# EAGLE schematic mainBoard (EAGLE 9.6.2)
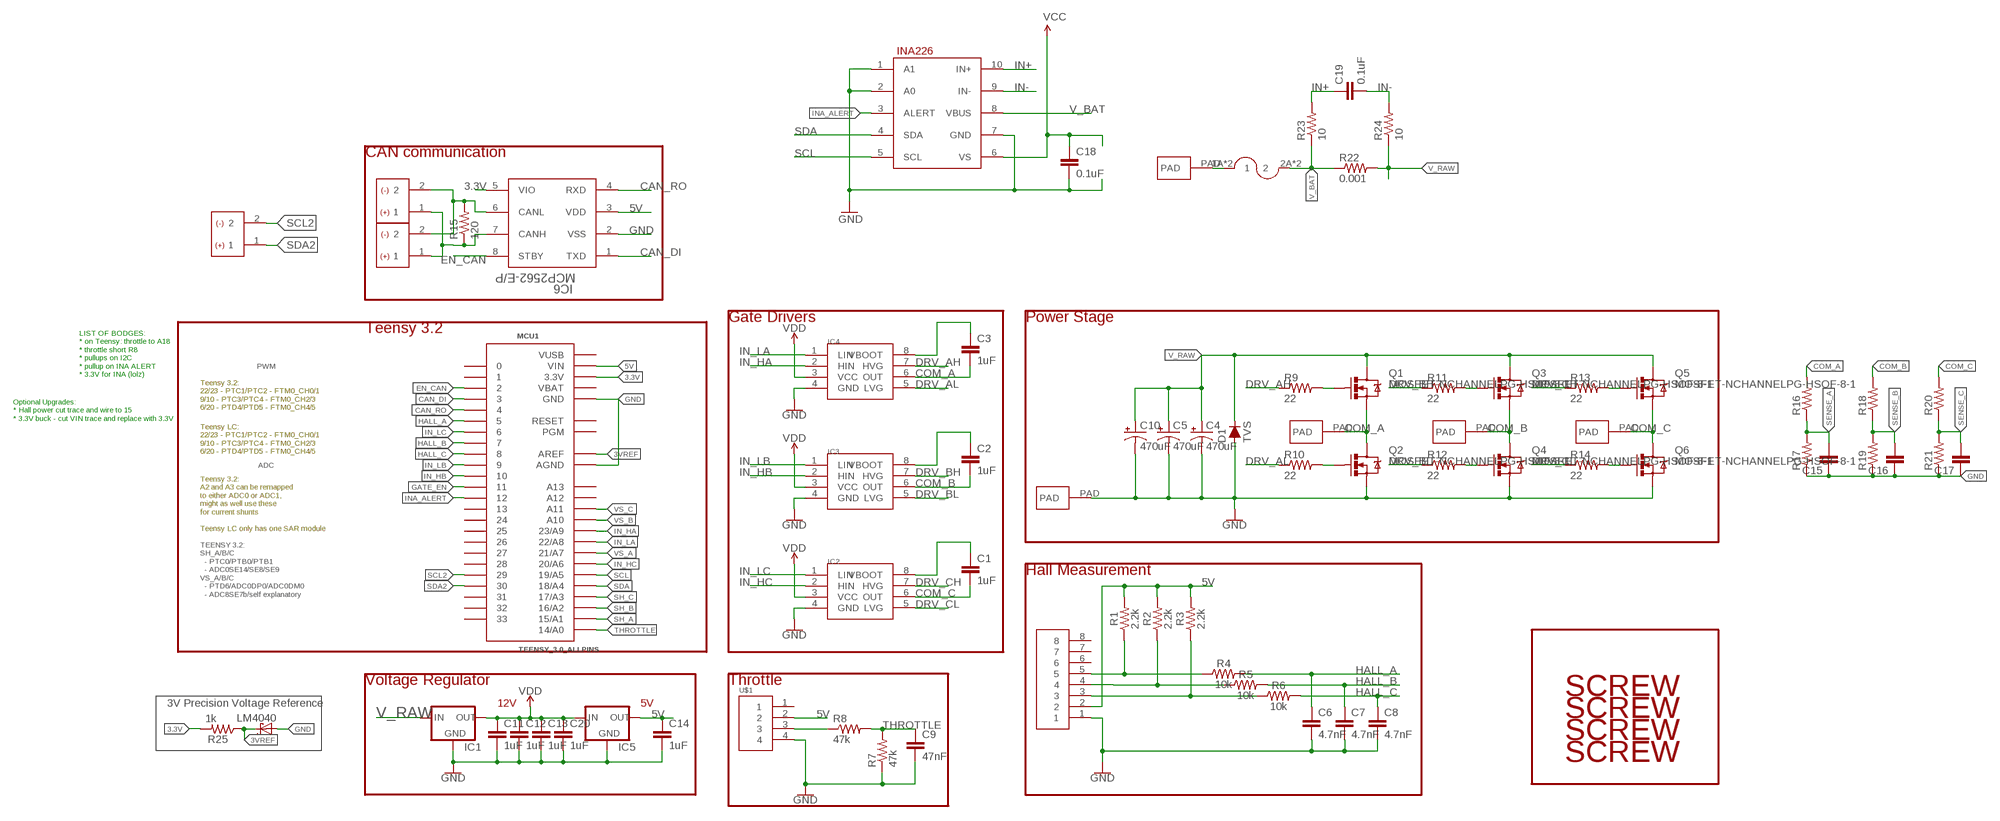
[diagram p0: schematic, sheet 1, part 1 of 2]
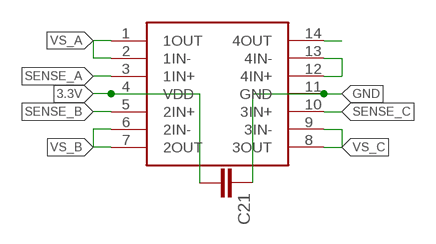
[diagram p1: schematic, sheet 1, part 2 of 2]

## Parts
C1  1uF  CAPKIT  [CAP-PTH-SMALL-KIT]
C2  1uF  CAPKIT  [CAP-PTH-SMALL-KIT]
C3  1uF  CAPKIT  [CAP-PTH-SMALL-KIT]
C4  470uF  1000UF-RADIAL-5MM-25V-20%  [CPOL-RADIAL-5MM-10MM]
C5  470uF  1000UF-RADIAL-5MM-25V-20%  [CPOL-RADIAL-5MM-10MM]
C6  4.7nF  CAP0603-CAP  [0603-CAP]
C7  4.7nF  CAP0603-CAP  [0603-CAP]
C8  4.7nF  CAP0603-CAP  [0603-CAP]
C9  47nF  CAP0603-CAP  [0603-CAP]
C10  470uF  1000UF-RADIAL-5MM-25V-20%  [CPOL-RADIAL-5MM-10MM]
C11  1uF  CAPKIT  [CAP-PTH-SMALL-KIT]
C12  1uF  CAPKIT  [CAP-PTH-SMALL-KIT]
C13  1uF  CAPKIT  [CAP-PTH-SMALL-KIT]
C14  1uF  CAPKIT  [CAP-PTH-SMALL-KIT]
C15  CAP0603-CAP  [0603-CAP]
C16  CAP0603-CAP  [0603-CAP]
C17  CAP0603-CAP  [0603-CAP]
C18  0.1uF  CAP0603-CAP  [0603-CAP]
C19  0.1uF  CAP0603-CAP  [0603-CAP]
C20  1uF  CAPKIT  [CAP-PTH-SMALL-KIT]
C21  CAP0603-CAP  [0603-CAP]
CAN1  HEADER2  [2PINVALULOK]
CAN2  HEADER2  [2PINVALULOK]
D1  TVS  DIODE-PTH  [DIODE-1N4001]
I2C  HEADER2  [2PINVALULOK]
IC1  V_REG_78XX  [V78W_BACKWARDS]
IC2  L6387EDIP8  [DIP762W53P254L1092H508Q8B]
IC3  L6387EDIP8  [DIP762W53P254L1092H508Q8B]
IC4  L6387EDIP8  [DIP762W53P254L1092H508Q8B]
IC5  V_REG_78XXV78W  [V78W]
IC6  MCP2562-E/P  [PDIP8_300MC]
IC7  INA226  [PSOP-10]
J3  FUSE  [AUTO_FUSE]
MCU1  TEENSY_3.0_ALLPINS  [TEENSY_3.0_ALLPINS]
Q1  MOSFET-NCHANNELPG-HSOF-8-1  [PG-HSOF-8-1]
Q2  MOSFET-NCHANNELPG-HSOF-8-1  [PG-HSOF-8-1]
Q3  MOSFET-NCHANNELPG-HSOF-8-1  [PG-HSOF-8-1]
Q4  MOSFET-NCHANNELPG-HSOF-8-1  [PG-HSOF-8-1]
Q5  MOSFET-NCHANNELPG-HSOF-8-1  [PG-HSOF-8-1]
Q6  MOSFET-NCHANNELPG-HSOF-8-1  [PG-HSOF-8-1]
R1  2.2k  RESISTOR0603  [0603]
R2  2.2k  RESISTOR0603  [0603]
R3  2.2k  RESISTOR0603  [0603]
R4  10k  RESISTOR0603  [0603]
R5  10k  RESISTOR0603  [0603]
R6  10k  RESISTOR0603  [0603]
R7  47k  RESISTOR0603-RES  [0603-RES]
R8  47k  RESISTOR0603-RES  [0603-RES]
R9  22  RESISTOR0603-RES  [0603-RES]
R10  22  RESISTOR0603-RES  [0603-RES]
R11  22  RESISTOR0603-RES  [0603-RES]
R12  22  RESISTOR0603-RES  [0603-RES]
R13  22  RESISTOR0603-RES  [0603-RES]
R14  22  RESISTOR0603-RES  [0603-RES]
R15  120  RESISTOR0603-RES  [0603-RES]
R16  RESISTOR0603-RES  [0603-RES]
R17  RESISTOR0603-RES  [0603-RES]
R18  RESISTOR0603-RES  [0603-RES]
R19  RESISTOR0603-RES  [0603-RES]
R20  RESISTOR0603-RES  [0603-RES]
R21  RESISTOR0603-RES  [0603-RES]
R22  0.001  RESISTOR2512  [R2512]
R23  10  RESISTOR0603-RES  [0603-RES]
R24  10  RESISTOR0603-RES  [0603-RES]
R25  1k  RESISTOR0603-RES  [0603-RES]
U$1  HEADER4VALULOK  [4PINVALULOK]
U$2  OPAMP_QUAD  [TSSOP-14]
U$4  PAD  [PAD]
U$5  PAD  [PAD]
U$6  PAD  [PAD]
U$7  PAD  [PAD]
U$8  PAD  [PAD]
U$10  SCREW  [M3HOLE]
U$11  SCREW  [M3HOLE]
U$12  SCREW  [M3HOLE]
U$13  SCREW  [M3HOLE]
U$14  HEADER8  [8PINVALULOK]
U$15  LM4040  [SOT23-3]

## Nets
3.3V: C21.2 IC6.5(VIO) MCU1.3.3V MCU1.3.3V1(3.3V) MCU1.3.3V2(3.3V) R25.2 U$2.4(VDD)
3VREF: MCU1.AREF R25.1 U$15.1(C)
5V: C14.1 IC5.OUT IC6.3(VDD) MCU1.VIN R1.2 R2.2 R3.2 U$1.2 U$14.2
CAN_DI: IC6.1(TXD) MCU1.3
CAN_RO: IC6.4(RXD) MCU1.4
CANH: CAN1.1 CAN2.1 IC6.7(CANH) R15.1
CANL: CAN1.2 CAN2.2 IC6.6(CANL) R15.2
COM_A: C3.2 IC4.6(OUT) Q1.S Q2.D R16.2 U$6.PAD
COM_B: C2.2 IC3.6(OUT) Q3.S Q4.D R18.2 U$7.PAD
COM_C: C1.2 IC2.6(OUT) Q5.S Q6.D R20.2 U$8.PAD
DRV_AH: IC4.7(HVG) R9.1
DRV_AL: IC4.5(LVG) R10.1
DRV_BH: IC3.7(HVG) R11.1
DRV_BL: IC3.5(LVG) R12.1
DRV_CH: IC2.7(HVG) R13.1
DRV_CL: IC2.5(LVG) R14.1
EN_CAN: IC6.8(STBY) MCU1.2
GATE_EN: MCU1.11
GND: C4.- C5.- C6.2 C7.2 C8.2 C9.2 C10.- C11.2 C12.2 C13.2 C14.2 C15.1 C16.1 C17.1 C18.2 C20.2 C21.1 D1.A IC1.GND IC2.4(GND) IC3.4(GND) IC4.4(GND) IC5.GND IC6.2(VSS) IC7.1(A1) IC7.2(A0) IC7.7(GND) MCU1.AGND MCU1.GND MCU1.GND1(GND) MCU1.GND2(GND) Q2.S Q4.S Q6.S R7.1 R17.1 R19.1 R21.1 U$1.4 U$2.11(GND) U$5.PAD U$14.1 U$15.2(A)
HALL_A: C6.1 MCU1.5 R4.2
HALL_B: C7.1 MCU1.7 R5.2
HALL_C: C8.1 MCU1.8 R6.2
IN+: C19.1 IC7.10(IN+) R23.2
IN-: C19.2 IC7.9(IN-) R24.2
IN_HA: IC4.2(HIN) MCU1.23/A9
IN_HB: IC3.2(HIN) MCU1.10
IN_HC: IC2.2(HIN) MCU1.20/A6
IN_LA: IC4.1(LIN) MCU1.22/A8
IN_LB: IC3.1(LIN) MCU1.9
IN_LC: IC2.1(LIN) MCU1.6
INA_ALERT: IC7.3(ALERT) MCU1.12
N$1: C1.1 IC2.8(VBOOT)
N$2: R3.1 R6.1 U$14.3
N$3: C2.1 IC3.8(VBOOT)
N$4: R2.1 R5.1 U$14.4
N$5: C3.1 IC4.8(VBOOT)
N$6: R1.1 R4.1 U$14.5
N$7: R8.1 U$1.3
N$9: Q1.G R9.2
N$10: Q2.G R10.2
N$11: Q3.G R11.2
N$12: Q4.G R12.2
N$13: Q5.G R13.2
N$14: Q6.G R14.2
N$26: U$2.12(4IN+) U$2.13(4IN-)
N$27: U$2.14(4OUT)
SCL: IC7.5(SCL) MCU1.19/A5
SCL2: I2C.2 MCU1.29
SDA: IC7.4(SDA) MCU1.18/A4
SDA2: I2C.1 MCU1.30
SENSE_A: C15.2 R16.1 R17.2 U$2.3(1IN+)
SENSE_B: C16.2 R18.1 R19.2 U$2.5(2IN+)
SENSE_C: C17.2 R20.1 R21.2 U$2.10(3IN+)
SH_A: MCU1.15/A1
SH_B: MCU1.16/A2
SH_C: MCU1.17/A3
THROTTLE: C9.1 MCU1.14/A0 R7.2 R8.2
V_BAT: IC7.8(VBUS) J3.2A J3.2B R22.1 R23.1
V_PREFUSE: J3.1A J3.1B U$4.PAD
V_RAW: C4.+ C5.+ C10.+ D1.C IC1.IN Q1.D Q3.D Q5.D R22.2 R24.1
VCC: C18.1 IC7.6(VS)
VDD: C11.1 C12.1 C13.1 C20.1 IC1.OUT IC2.3(VCC) IC3.3(VCC) IC4.3(VCC) IC5.IN
VS_A: MCU1.21/A7 U$2.1(1OUT) U$2.2(1IN-)
VS_B: MCU1.A10 U$2.6(2IN-) U$2.7(2OUT)
VS_C: MCU1.A11 U$2.8(3OUT) U$2.9(3IN-)
Unconnected: MCU1.0 MCU1.1 MCU1.13 MCU1.24 MCU1.25 MCU1.26 MCU1.27 MCU1.28 MCU1.31 MCU1.32 MCU1.33 MCU1.A12 MCU1.A13 MCU1.PGM MCU1.RESET U$1.1 U$14.6 U$14.7 U$14.8

## Notes on the sheet
- CAN communication
- Gate Drivers | Power Stage
- Teensy 3.2
- PWM
- LIST OF BODGES:
  * on Teensy: throttle to A18
  * throttle short R8
  * pullups on I2C
  * pullup on INA ALERT
  * 3.3V for INA (lolz)
- Teensy 3.2:
  22/23 - PTC1/PTC2 - FTM0_CH0/1
  9/10 - PTC3/PTC4 - FTM0_CH2/3
  6/20 - PTD4/PTD5 - FTM0_CH4/5
- Optional Upgrades:
  * Hall power cut trace and wire to 15
  * 3.3V buck - cut VIN trace and replace with 3.3V
- Teensy LC:
  22/23 - PTC1/PTC2 - FTM0_CH0/1
  9/10 - PTC3/PTC4 - FTM0_CH2/3
  6/20 - PTD4/PTD5 - FTM0_CH4/5
- ADC
- Teensy 3.2:
  A2 and A3 can be remapped
  to either ADC0 or ADC1,
  might as well use these
  for current shunts
  
  Teensy LC only has one SAR module
- Hall Measurement
- TEENSY 3.2:
  SH_A/B/C
    - PTC0/PTB0/PTB1
    - ADC0SE14/SE8/SE9
  VS_A/B/C
    - PTD6/ADC0DP0/ADC0DM0
    - ADC8SE7b/self explanatory
- Voltage Regulator | Throttle
- 3V Precision Voltage Reference | 12V | 5V

## Power pins joined to a net without a drawn wire
VBAT: MCU1.VBAT
VUSB: MCU1.VUSB

## Library data of the parts
C1-C3 C11-C14 C20 = SparkFun-Capacitors:CAP: Capacitor Standard 0603 ceramic capacitor, and 0.1" leaded capacitor.
C4 C5 C10 = SparkFun-Capacitors:1000UF: 1,000µF/1mF ceramic capacitors A capacitor is a passive two-terminal electrical component used to store electrical energy temporarily in an electric field. CAP-08070; PROD_ID: CAP-09538; VALUE: 1mF
C6-C9 C15-C19 C21 = SparkFun-Passives:CAP: Capacitor Standard 0603 ceramic capacitor, and 0.1" leaded capacitor.
CAN1 CAN2 I2C = Custom_old:HEADER2
D1 = SparkFun-DiscreteSemi:DIODE: Diode These are standard reverse protection diodes and small signal diodes. SparkFun Products: SparkFun SparkPunk Sound Kit <https://www.sparkfun.com/products/11177> SparkFun ESP8266 Thing <https://www.sparkfun.com/products/13231>; PROD_ID: DIO-09176; VALUE: 1A/50V/1.1V
IC1 IC5 = 2018:V_REG_78XX: Voltage Regulator Standard 7805 5V regulator. IGO (Input Ground Output). Spark Fun Electronics SKU : COM-00107
IC2-IC4 = Custom_old:L6387E
IC6 = Custom_new:MCP2562-E/P; MANUFACTURER_PART_NUMBER: MCP2562EP; VENDOR: Microchip
IC7 = Custom_old:INA226
J3 = Custom_old:FUSE
MCU1 = Teensy3.0:TEENSY_3.0_ALLPINS: Teensy 3.0 with all pin holes and optional SMD-mount unshrouded header on bottom of Teensy 3.0. For more basic versions, see 'Basic', '+4' and 'AllAnalogPins'. Requires the installation of a un-shrouded SMD header on the underside of the Teensy 3.0
Q1-Q6 = Custom_old:MOSFET-NCHANNEL: Generic NMOS footprint
R1-R6 = SparkFun-Resistors:RESISTOR: Generic Resistor Package
R7-R21 R23-R25 = SparkFun-Passives:RESISTOR: Resistor Basic schematic elements and footprints for 0603, 1206, and PTH resistors.
R22 = SparkFun-Resistors:RESISTOR: Resistor Basic schematic elements and footprints for 0603, 1206, and PTH resistors.
U$1 = Custom_old:HEADER4
U$2 = 2018:OPAMP_QUAD
U$4-U$8 = Custom_old:PAD
U$10-U$13 = Custom_old:SCREW
U$14 = Custom_old:HEADER8
U$15 = 2018:LM4040